# Altium schematic sheet Wacky Hat Schematic.SchDoc
size A3; Address1: ECE Department; Address2: University of Canterbury; Address3: Christchurch 8041; Address4: New Zealand; Revision: 1
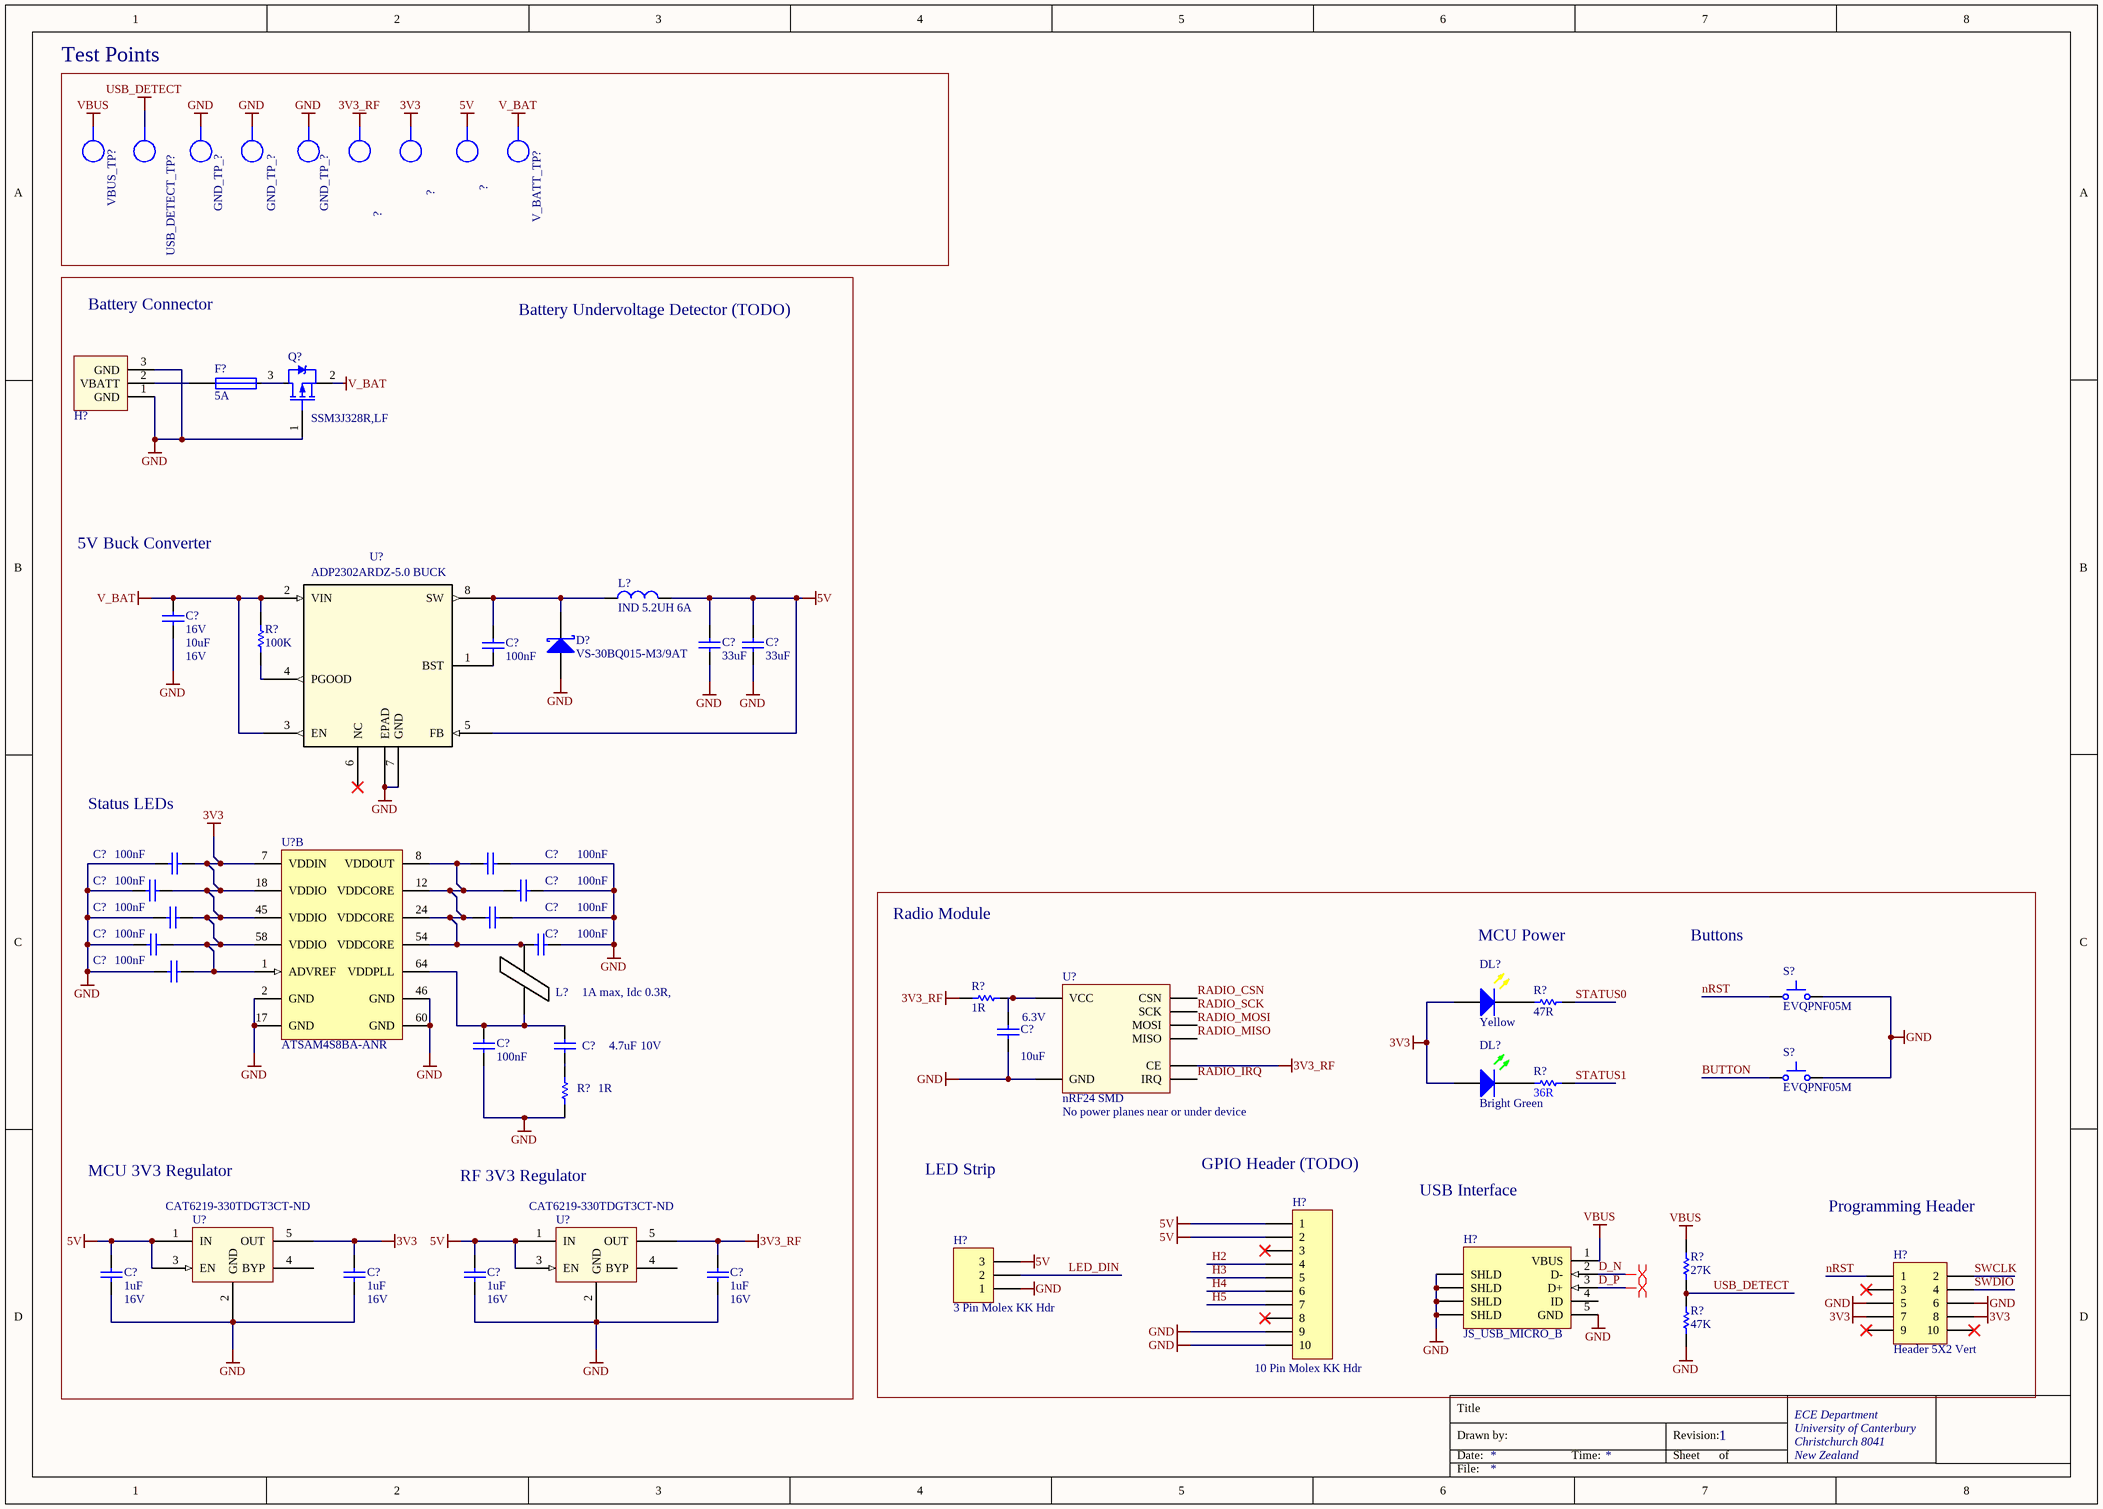
[diagram p0: Wacky Hat Schematic.SchDoc]

## Parts
(Parts that share a designator on the sheet are numbered #1, #2 ... from top to bottom, then left to right.)
?#1  TP  [TP_1206]  (value not drawn)  (no BOM)
?#2  TP  [TP_1206]  (value not drawn)  (no BOM)
?#3  TP  [TP_1206]  (value not drawn)  (no BOM)
C?#1  Voltage - Rated: 16V  [CAPC2012L]  (hidden comment: 10uF)
C?#2  100nF  [CAPC1608L]
C?#3  33uF  [CAPC2012L]
C?#4  33uF  [CAPC2012L]
C?#5  100nF  [CAPC1608L]
C?#6  100nF  [CAPC1608L]
C?#7  100nF  [CAPC1608L]
C?#8  100nF  [CAPC1608L]
C?#9  100nF  [CAPC1608L]
C?#10  100nF  [CAPC1608L]
C?#11  100nF  [CAPC1608L]
C?#12  100nF  [CAPC1608L]
C?#13  100nF  [CAPC1608L]
C?#14  Voltage - Rated: 6.3V  [CAPC1608L]  (hidden comment: 10uF)
C?#15  100nF  [CAPC1608L]
C?#16  Max Voltage: 10V  [CAPC1608N]  (hidden comment: 4.7uF)
C?#17  Max Voltage: 16V  [CAPC1608L]  (hidden comment: 1uF)
C?#18  Max Voltage: 16V  [CAPC1608L]  (hidden comment: 1uF)
C?#19  Max Voltage: 16V  [CAPC1608L]  (hidden comment: 1uF)
C?#20  Max Voltage: 16V  [CAPC1608L]  (hidden comment: 1uF)
D?  VS-30BQ015-M3/9AT  [SMC]
DL?#1  Yellow  [WL-SMCW0603]
DL?#2  Bright Green  [WL-SMCW0603]
F?  5A  [RESC3216N]
GND_TP_?#1  TP  [TP_1206]  (value not drawn)  (no BOM)
GND_TP_?#2  TP  [TP_1206]  (value not drawn)  (no BOM)
GND_TP_?#3  TP  [TP_1206]  (value not drawn)  (no BOM)
H?#1  Battery_HEADER_3pin  [BATT_HEADER_3POS]  (value not drawn)
H?#2  10 Pin Molex KK Hdr  [MOLEX_KK_10_HDR]
H?#3  JS_USB_MICRO_B  [FCI_USB_10118194-0001LF]
H?#4  Header 5X2 Vert  [IDC2.54-V10D]
H?#5  3 Pin Molex KK Hdr  [MOLEX_KK_3_HDR]
L?#1  IND 5.2UH 6A  [INDUCTOR5u2]
L?#2  1A max, Idc 0.3R,  [INDC3216L]
Q?  SSM3J328R,LF  [SOT23_L]
R?#1  100K  [RESC1608L]
R?#2  1R  [RESC3216L]
R?#3  47R  [RESC1608L]
R?#4  36R  [RESC1608L]
R?#5  1R  [RESC3216L]
R?#6  27K  [RESC1608L]
R?#7  47K  [RESC1608N]
S?#1  EVQPNF05M  [EVQPNF05M]
S?#2  EVQPNF05M  [EVQPNF05M]
U?#1  ADP2302ARDZ-5.0 BUCK  [RD_8_1]
U?#2  ATSAM4S8BA-ANR  [LQFP64_L]  (part B of 2)
U?#3  nRF24 SMD  Warning: No power planes near or under device  [NRF24]
U?#4  Supplier Part Number: CAT6219-330TDGT3CT-ND  [SOT95P280X145-5N]  (hidden comment: CAT6219-330TDGT3)
U?#5  Supplier Part Number: CAT6219-330TDGT3CT-ND  [SOT95P280X145-5N]  (hidden comment: CAT6219-330TDGT3)
USB_DETECT_TP?  TP  [TP_1206]  (value not drawn)  (no BOM)
V_BATT_TP?  TP  [TP_1206]  (value not drawn)  (no BOM)
VBUS_TP?  TP  [TP_1206]  (value not drawn)  (no BOM)

## Blocks framed on the sheet
Test Points: ?#1-?#3 GND_TP_?#1-GND_TP_?#3 USB_DETECT_TP? V_BATT_TP? VBUS_TP?

## Nets
3V3: ?#2.1 C?#5.2 C?#7.2 C?#9.2 C?#11.2 C?#13.2 C?#18.2 DL?#1.2(A) DL?#2.2(A) H?#4.7 H?#4.8 U?#2.1(ADVREF) U?#2.7(VDDIN) U?#2.18(VDDIO) U?#2.45(VDDIO) U?#2.58(VDDIO) U?#4.5(OUT)
3V3_RF: ?#1.1 C?#20.2 R?#2.1 U?#3.3(CE) U?#5.5(OUT)
5V: ?#3.1 C?#3.2 C?#4.2 C?#17.2 C?#19.2 H?#2.1 H?#2.2 H?#5.3 L?#1.2 U?#1.5(FB) U?#4.1(IN) U?#4.3(EN) U?#5.1(IN) U?#5.3(EN)
GND: C?#1.1 C?#3.1 C?#4.1 C?#5.1 C?#6.2 C?#7.1 C?#8.2 C?#9.1 C?#10.2 C?#11.1 C?#12.2 C?#13.1 C?#14.1 C?#15.1 C?#17.1 C?#18.1 C?#19.1 C?#20.1 D?.1(A) GND_TP_?#1.1 GND_TP_?#2.1 GND_TP_?#3.1 H?#1.1(GND) H?#1.3(GND) H?#2.9 H?#2.10 H?#3.5(GND) H?#3.6(SHLD) H?#4.5 H?#4.6 H?#5.1 Q?.1 R?#5.1 R?#7.1 S?#1.2 S?#2.2 U?#1.7(GND) U?#1.EPAD U?#2.2(GND) U?#2.17(GND) U?#2.46(GND) U?#2.60(GND) U?#3.2(GND) U?#4.2(GND) U?#5.2(GND)
USB_DETECT: R?#6.1 R?#7.2 USB_DETECT_TP?.1
V_BAT: C?#1.2 Q?.2 R?#1.2 U?#1.2(VIN) U?#1.3(EN) V_BATT_TP?.1
VBUS: H?#3.1(VBUS) R?#6.2 VBUS_TP?.1
BUTTON: S?#2.1
D_N: H?#3.2(D-)
D_P: H?#3.3(D+)
H2: H?#2.4
H3: H?#2.5
H4: H?#2.6
H5: H?#2.7
LED_DIN: H?#5.2
nRST: H?#4.1 S?#1.1
RADIO_CSN: U?#3.4(CSN)
RADIO_IRQ: U?#3.8(IRQ)
RADIO_MISO: U?#3.7(MISO)
RADIO_MOSI: U?#3.6(MOSI)
RADIO_SCK: U?#3.5(SCK)
STATUS0: R?#3.2
STATUS1: R?#4.2
SWCLK: H?#4.2
SWDIO: H?#4.4
NetC?#2_1: C?#2.1 U?#1.1(BST)
NetC?#2_2: C?#2.2 D?.2(K) L?#1.1 U?#1.8(SW)
NetC?#6_1: C?#6.1 C?#8.1 C?#10.1 C?#12.1 L?#2.2 U?#2.8(VDDOUT) U?#2.12(VDDCORE) U?#2.24(VDDCORE) U?#2.54(VDDCORE)
NetC?#14_2: C?#14.2 R?#2.2 U?#3.1(VCC)
NetC?#15_2: C?#15.2 C?#16.2 L?#2.1 U?#2.64(VDDPLL)
NetC?#16_1: C?#16.1 R?#5.2
NetDL?#1_1: DL?#1.1(K) R?#3.1
NetDL?#2_1: DL?#2.1(K) R?#4.1
NetF?_1: F?.1 H?#1.2(VBATT)
NetF?_2: F?.2 Q?.3
NetR?#1_1: R?#1.1 U?#1.4(PGOOD)

Not connected (* = marked no-connect by the designer): H?#2 3* 8*; H?#3 4(ID); H?#4 3* 9* 10*; U?#1 6(NC)*; U?#4 4(BYP); U?#5 4(BYP)

## Layout directives
differential pair: D_N, D_P

## Notes on the sheet
- Battery Connector
- Battery Undervoltage Detector (TODO)
- 5V Buck Converter
- (near C?#5) Status LEDs
- Radio Module
- MCU Power
- Buttons
- MCU 3V3 Regulator
- RF 3V3 Regulator
- LED Strip
- (near H?#2) GPIO Header (TODO)
- USB Interface
- Programming Header
- Title
- Drawn by:
- Date:
- Time:
- Revision:
- Sheet
- of
- File:

## Library data of the parts
?#1-?#3 GND_TP_?#1-GND_TP_?#3 USB_DETECT_TP? V_BATT_TP? VBUS_TP? = TP_1206: Test-Point 3.3x1.6x2.1mm SMD; Manufacturer: Harwin Inc; Manufacturer Part Number: S1751-46R; Manufacturer PN: *; Storage Location: ProtoPlace; Mounting Type: Surface Mount; Type: PC Test Point; Supplier 1: Digi-Key; Supplier Part Number 1: 952-1478-2-ND; Supplier 2: Farnell; Supplier Part Number 2: 1826282; Supplier: ECE Dept; Value: TP
C?#1 = CC_10uF_16V_0805: CAP CER 10uF X5R 16V 0805; Manufacturer: Samsung Electro-Mechanics; Manufacturer Part Number: CL21A106KOQNNWE; Note: Footprint corresponds to dimensions for bulk cassette packaging. This case size has tightened tolerances.; Tolerance: ±10%; Notification: Current market demand for these product types have resulted in fluctuating and extending lead times. Lead times may differ.; PackageReference: 0805; Code_IPC: 2012[0805]; Supplier 1: Digi-Key; RoHS: RoHS Compliant; Category: Capacitors; Stock 1: 20000; Pricing 1: 1=0.35, 10=0.25, 100=0.1178, 500=0.08254, 1000=0.06831 (NZD); Packaging: Cut Tape (CT); Part Status: Active; Temperature Coefficient: X5R; Operating Temperature: -55°C ~ 85°C; Features: -; Ratings: -; Applications: General Purpose; Mounting Type: Surface Mount, MLCC; Package / Case: 0805 (2012 Metric); Size / Dimension: 0.079" L x 0.049" W (2.00mm x 1.25mm); Height - Seated (Max): -; Thickness (Max): 0.055" (1.40mm); Lead Spacing: -; Lead Style: -; ComponentLink1URL: http://www.samsungsem.com/kr/support/product-search/mlcc/CL21A106KOQNNWE.jsp; ComponentLink1Description: http://www.samsungsem.com/kr/support/product-search/mlcc/CL21A106KOQNNWE.jsp; Supplier Part Number 1: 1276-2894-1-ND; Value: 10uF; Max Voltage: 16V
C?#2 C?#5-C?#13 C?#15 = CC_100nF_0603: CAP CER 100nF X7R +-10% 50V 0603; PackageReference: 0603; Code_IPC: 1608 [0603]; Verify: *; Supplier: ECE Dept; Storage Location: PCB Assembly WS; Value: 100nF
C?#3 C?#4 = CC_33uF_6V3_0805: CAP CER 33uF X5R 6V3 0805; Manufacturer: TDK Corporation; Manufacturer Part Number: C2012X5R0J336M125AC; Tolerance: ±20%; Voltage - Rated: 6.3V; Notification: Current market demand for these product types have resulted in fluctuating and extending lead times. Lead times may differ.; Supplier 1: Digi-Key; RoHS: RoHS Compliant; Category: Capacitors; Stock 1: 20000; Pricing 1: 1=1.65, 10=1.262, 100=0.9023, 500=0.6985, 1000=0.60149 (NZD); Packaging: Cut Tape (CT); Part Status: Active; Temperature Coefficient: X5R; Operating Temperature: -55°C ~ 85°C; Features: Low ESL; Ratings: -; Applications: General Purpose; Failure Rate: -; Mounting Type: Surface Mount, MLCC; Package / Case: 0805 (2012 Metric); Size / Dimension: 0.079" L x 0.049" W (2.00mm x 1.25mm); Height - Seated (Max): -; Thickness (Max): 0.057" (1.45mm); Lead Spacing: -; Lead Style: -; ComponentLink1URL: https://product.tdk.com/info/en/catalog/datasheets/mlcc_commercial_general_en.pdf; ComponentLink1Description: https://product.tdk.com/info/en/catalog/datasheets/mlcc_commercial_general_en.pdf; Supplier Part Number 1: 445-5986-1-ND; Value: 33uF
C?#14 = CC_10uF_0603: CAP CER 10UF X5R +-20% 6V3 0603; Supplier: ECE Dept; Storage Location: PCB Assembly WS; Value: 10uF
C?#16 = CC_4.7uF_0603: CAP CER 4.7uF X5R +-20%  10V 0603; Note: Footprint corresponds to dimensions for bulk cassette packaging. This case size has tightened tolerances.; PackageReference: 0805; Code_IPC: 2012[0805]; Verify: *; Supplier: ECE Dept; Storage Location: PCB Assembly WS; Value: 4.7uF
C?#17-C?#20 = CC_1uF_0603: CAP CER 1uF Y5V -20% +80% 16V 0603; PackageReference: 0603; Code_IPC: 1608 [0603]; Verify: *; Supplier: ECE Dept; Storage Location: PCB Assembly WS; Value: 1uF
D? = DS_VS-30BQ015-M3: DIODE, SCHOTTKY, 3A, 15V, DO-214AB / SMC; Manufacturer: Vishay Semiconductors; Forward Voltage: 350mV; Max Forward Surge Current (Ifsm): 650A; Peak Reverse Current: 4mA; Average Rectified Current: 3A; Max Reverse Voltage (DC): 15V; Supplier: Digi-Key; ComponentLink1URL: https://datasheet.ciiva.com/36181/vs-30bq015-m3-9at-36181258.pdf; ComponentLink1Description: https://datasheet.ciiva.com/36181/vs-30bq015-m3-9at-36181258.pdf; Supplier 1: Digi-Key; Supplier 2: Element14; Supplier Part Number 1: VS-30BQ015-M3/9ATGIDKR-ND; Supplier Part Number 2: 2628288; Supplier Part Number: VS-30BQ015-M3/9AT-ND; Manufacturer Part Number: VS-30BQ015-M3/9AT
DL?#1 = DL_150060YS75000: LED Yellow 120mcd 0603 SMD; Manufacturer: WURTH ELEKTRONIK; Forward Current If: 30; Forward Voltage: 2; Wavelength Typ: 590; Lens Shape: Rectangular; Viewing Angle: 140°; Luminous Intensity: 120; LED Mounting: SMD; Supplier 1: Farnell; Supplier Part Number 1: 2322074; Manufacturer Part Number: 150060YS75000; Storage Location: PCB Assembly WS; Supplier: ECE Dept; LED Colour: Yellow
DL?#2 = DL_150060VS75000: LED Bright Green 40mcd 0603 SMD; Manufacturer: WURTH ELEKTRONIK; Forward Current If: 30; Forward Voltage: 2; Viewing Angle: 140°; Wavelength Typ: 570; Luminous Intensity: 40; LED Mounting: SMD; Supplier 1: Farnell; Supplier Part Number 1: 2322073; Manufacturer Part Number: 150060VS75000; Storage Location: PCB Assembly WS; Supplier: ECE Dept; LED Colour: Bright Green
F? = FS_Fuse_5.0A: Fuse 5.0A Fast Acting 1206 SMD; Manufacturer Part Number: C1F5; Manufacturer: Bel TRP; Voltage Rating (AC): 125V; Voltage Rating (DC): 63V; DC Cold Resistance: 19mR; Fuse Type: Board Mount (Cartridge Style Excluded); Approvals: CE,cURus; Mount: Surface Mount; Case/Package: 1206; Number of Pins: 2; Case Code (Metric): 3216; Case Code (Imperial): 1206; Contact Plating: Nickel,Tin; Min Operating Temperature: -55°C; Max Operating Temperature: 125°C; Packaging: Tape and Reel; Voltage Rating: 125V; Length: 0.126inch; Width: 0.062inch; Supplier 1: Digi-Key; Stock 1: 725; Pricing 1: 1=0.32, 5=0.312, 10=0.298, 50=0.2662, 100=0.2479, 250=0.22032, 500=0.1836, 1000=0.17442 (USD); ComponentLink1URL: http://www.farnell.com/datasheets/2571625.pdf; ComponentLink1Description: http://www.farnell.com/datasheets/2571625.pdf; ComponentLink2URL: http://belfuse.com/pdfs/C1F.pdf; ComponentLink2Description: http://belfuse.com/pdfs/C1F.pdf; ComponentLink3URL: http://www.mouser.com/ds/2/643/C1F-594910.pdf; ComponentLink3Description: http://www.mouser.com/ds/2/643/C1F-594910.pdf; ComponentLink4URL: https://belfuse.com/resources/StewartConnector/C1F.pdf; ComponentLink4Description: https://belfuse.com/resources/StewartConnector/C1F.pdf; Current Rating: 5A; Supplier Part Number 1: 507-1886-1-ND; Supplier 2: Element14; Supplier Part Number 2: 2848595; Value: 5A
H?#1 = Battery_HEADER_3pin: 3Pin Header 2.54mm spacing
H?#2 = JA_MOLEX_KK_10POS: CONN HEADER 10POS 2.54mm VERT_ Thru Hole; Supplier 1: Farnell; Supplier Part Number 1: 1756828; Supplier: ECE Dept; Storage Location: ECE Dept Store; Value: 10 Pin Molex KK Hdr
H?#3 = JS_USB_MICRO_B_SMT: CONN USB MICRO B RECPT SMT R/A; Manufacturer: FCI; Manufacturer Part Number: 10118194-0001LF; Gender: Receptacle; Number of Contacts: 5; Specifications: USB 2.0; Supplier 1: Digi-Key; Supplier Part Number 1: 609-4618-1-ND; Features: Shielded, Solder Retention; Mounting Type: Surface Mount, Right Angle, Horizontal
H?#4 = JA_HDR_IDC_5X2_VERT: IDC Header, 2,54mm, 10-Pin, Vert; Supplier: ECE Dept; Supplier 1: Farnell; Supplier Part Number 1: 1096985; Storage Location: ECE Dept Store
H?#5 = JA_MOLEX_KK_3POS: CONN HEADER 3POS 2.54mm VERT_Thru Hole; Manufacturer: Molex; Manufacturer PN: 22-23-2031; Supplier Part Number 1: 9731156; Supplier: ECE Dept; Supplier 1: Farnell; Storage Location: ECE Dept Store; Value: 3 Pin Molex KK Hdr
L?#1 = CDRH104RNP-5R2NC: FIXED IND 5.2UH 6A 22 MOHM SMD; Manufacturer: Sumida America Components Inc.; Material - Core: Ferrite; Tolerance: ±30%; Current - Saturation: 5.6A; Shielding: Shielded; DC Resistance (DCR): 22 mOhm Max; Supplier 1: Digi-Key; Manufacturer Part Number: CDRH104RNP-5R2NC; RoHS: RoHS Compliant; Category: Inductors, Coils, Chokes; Stock 1: 3849; Pricing 1: 1=2.9, 10=2.678, 100=1.8743, 500=1.5173 (NZD); Packaging: Cut Tape (CT); Part Status: Active; Type: -; Q @ Freq: -; Frequency - Self Resonant: -; Ratings: -; Operating Temperature: -40°C ~ 100°C; Mounting Type: Surface Mount; Package / Case: Nonstandard; Supplier Device Package: -; Size / Dimension: 0.402" L x 0.394" W (10.20mm x 10.00mm); Height - Seated (Max): 0.157" (4.00mm); ComponentLink1URL: http://products.sumida.com/products/pdf/CDRH104R.pdf; ComponentLink1Description: http://products.sumida.com/products/pdf/CDRH104R.pdf; Supplier Part Number 1: 308-2280-1-ND
L?#2 = IN_Ferrite-Bead: Ferrite Bead, Rdc 0.3R, Z100MHZ 600R, Imax 1A, SMD 1206; Manufacturer: FAIR-RITE; Manufacturer PN: 2512066017Y1; DC Current Rating: 1; DC Resistance Max: 0.08; Ferrite Case Style: 1206 ^3216 Metric]; Frequency Range: 50MHz to 1; Impedance: 600; Impedance Tolerance: ± 25%; Supplier: ECE Dept; Storage Location: PCB Assembly WS; Ferrite Mounting: SMD; Supplier 1: Farnell; Supplier Part Number 1: 1612060; Manufacturer Part Number: 2512066017Y1; Value: 1A max, Idc 0.3R,
Q? = TM_SSM3J328R: MOSFET P-CH 20V 6A SOT23-3; Manufacturer: Toshiba; FET Feature: Logic Level Gate, 1.5V Drive; FET Type: MOSFET P-Channel, Metal Oxide; Gate Charge (Qg) @ Vgs: 12.8nC @ 4.5V; Input Capacitance (Ciss) @ Vds: 840pF @ 10V; Power - Max: 1W; Rds On Max: 29.8mR; Drain to Source Resistance: 47.4mR; Turn-On Delay Time: 32ns; Power Dissipation: 2W; Number of Channels: 1; Turn-Off Delay Time: 107ns; Gate to Source Voltage (Vgs): 8V; Input Capacitance: 840pF; Element Configuration: Single; Drain to Source Breakdown Voltage: -20V; Vgs(th) (Max) @ Id: 1V @ 1mA; Current - Continuous Drain (Id) @ 25° C: 6A; Drain to Source Voltage (Vdss): 20V; Package / Case: SOT-23-3 Flat Leads; Supplier Device Package: SOT-23F; Pricing: 1=0.79, 10=0.658, 25=0.5772, 100=0.4939, 250=0.42836, 500=0.36284, 1000=0.27972 (NZD); Storage Location: PCB Assembly WS; Supplier: Digi-Key; ComponentLink1URL: https://datasheet.ciiva.com/11158/ssm3j328r-datasheet-en-20140301-11158652.pdf; ComponentLink1Description: https://datasheet.ciiva.com/11158/ssm3j328r-datasheet-en-20140301-11158652.pdf; Supplier Part Number: SSM3J328RLFDKR-ND; Max Operating Temperature: 150°C; Mount: Surface Mount; Packaging: Tape and Reel; Min Operating Temperature: -55°C; Continuous Drain Current (ID): 6A; Radiation Hardening: No; Max Power Dissipation: 1W; Package Quantity: 3000; Case/Package: SOT-23-3; Number of Pins: 3; Number of Elements: 1; Supplier 1: Digi-Key; Supplier Part Number 1: SSM3J328RLFDKR-ND; Manufacturer Part Number: SSM3J328R,LF
R?#1 = RS_100K: RES 100K OHM 1/10W 5% 0603 SMD; Storage Location: PCB Assembly WS; Supplier: ECE Dept; Value: 100K
R?#2 R?#5 = RT_1R: RES 1R OHM 1/4W 5% 1206 SMD; Storage Location: PCB Assembly WS; Supplier: ECE Dept; Value: 1R
R?#3 = RS_47R: RES 47 OHM 1/10W 5% 0603 SMD; Storage Location: PCB Assembly WS; Supplier: ECE Dept; Value: 47R
R?#4 = RS_36R: RES 36 OHM 1/10W 5% 0603 SMD; Storage Location: PCB Assembly WS; Supplier: ECE Dept; Value: 36R
R?#6 = RS_27K: RES 27K OHM 1/10W 5% 0603 SMD; Storage Location: PCB Assembly WS; Supplier: ECE Dept; Value: 27K
R?#7 = RS_47K: RES 47.0K OHM 1/10W 5% 0603 SMD; Storage Location: PCB Assembly WS; Supplier: ECE Dept; Value: 47K
S?#1 S?#2 = WS_EVQPNF05M: Panasonic 6 x 3.5mm SMD Light Touch Switch Type SMD; PackageDescription: 6.0 x 3.5 mm; Supplier 1: Farnell; Supplier Part Number 1: 2079481; Manufacturer: Panasonic; Manufacturer PN: EVQPNF05M; Supplier 2: Digi-Key; Supplier Part Number 2: P13598SCT-ND; Storage Location: PCB Assembly WS; Supplier: ECE Dept
U?#1 = ADP2302ARDZ-5.0-R7: IC REG BUCK 5V 2A 8SOIC; Vendor: Analog Devices Inc; Frequency - Switching: 700kHz; Output Type: Fixed; Voltage - Input (Max): 20V; Manufacturer_Part_Number: ADP2302ARDZ-5.0-R7; Type: DEV; Value: Value; Supplier 1: Digi-Key; Current - Output: 2A; Voltage - Output (Min/Fixed): 5V; Supplier Part Number 1: ADP2302ARDZ-5.0-R7CT-ND
U?#2 = SE_ATSAM4S16BA-MU: IC MCU 32BIT 512KB FLASH 64LQFP; Manufacturer: Atmel; Connectivity: I²C, IrDA, Memory Card, SPI, SSC, UART/USART, USB; Core Processor: ARM® Cortex®-M4; Core Size: 32-Bit; Data Converters: A/D 11x12b, D/A 2x12b; Number of I/O: 47; Peripherals: Brown-out Detect/Reset, DMA, POR, PWM, WDT; Program Memory Size: 512KB (512K x 8); RAM Size: 128K x 8; Speed: 120MHz; Voltage - Supply (Vcc/Vdd): 1.62 V ~ 3.6 V; PackageVersion: revJ, Jul-2007; PackageReference: 64PS; PackageDescription: 64-Pin Quad Flat No-Lead (QFN) Sawn, 9 x 9 x 1.0 mm Body, 0.5 mm Pitch, Exposed Pad; Code_JEDEC: MO-220VMMD-3; ComponentLink1Description: Manufacturer URL; ComponentLink1URL: http://www.atmel.com/; ComponentLink2Description: SAM4S Series Datasheet; ComponentLink2URL: http://www.atmel.com/dyn/resources/prod_documents/11100.pdf; ComponentLink3Description: SAM4S Series Summary; ComponentLink3URL: http://www.atmel.com/dyn/resources/prod_documents/11100S.pdf; Supplier 1: Digi-Key; Package / Case: 64-LQFP; Packaging: Cut Tape (CT); Program Memory Type: FLASH; Supplier Part Number 1: ATSAM4S8BA-ANRCT-ND; Manufacturer Part Number: ATSAM4S8BA-ANR
U?#3 = NRF24: nRF24 SMD Module
U?#4 U?#5 = SV_CAT6219-330TDGT3: IC REG LIN 3.3V 500MA TSOT23-5; Voltage - Input (Max): 5.5V; Voltage Dropout (Max): 0.5V @ 500mA; Manufacturer Part Number: CAT6219-330TDGT3; Base Part Number: CAT6219; Current - Output: 500mA; Package / Case: SOT-23-5 Thin, TSOT-23-5; Supplier: Digi-Key; Supplier Device Package: TSOT-23-5; Voltage - Output (Min/Fixed): 3.3V; ComponentLink1URL: http://www.onsemi.com/pub/Collateral/CAT6219-D.PDF; ComponentLink1Description: http://www.onsemi.com/pub/Collateral/CAT6219-D.PDF; Supplier 1: Digi-Key